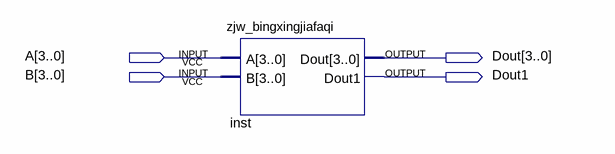
[diagram p0: schematic sheet]
// Quartus schematic Block1.bdf as structural Verilog: 1 symbols, 4 pins
module Block1 (
  input  [3:0] A,
  input  [3:0] B,
  output [3:0] Dout,
  output Dout1
);

  zjw_bingxingjiafaqi inst (.A(A), .B(B), .Dout(Dout), .Dout1(Dout[1]));

  assign Dout1 = Dout[1];
endmodule
